# Altium project Kame_PDB.PrjPCB
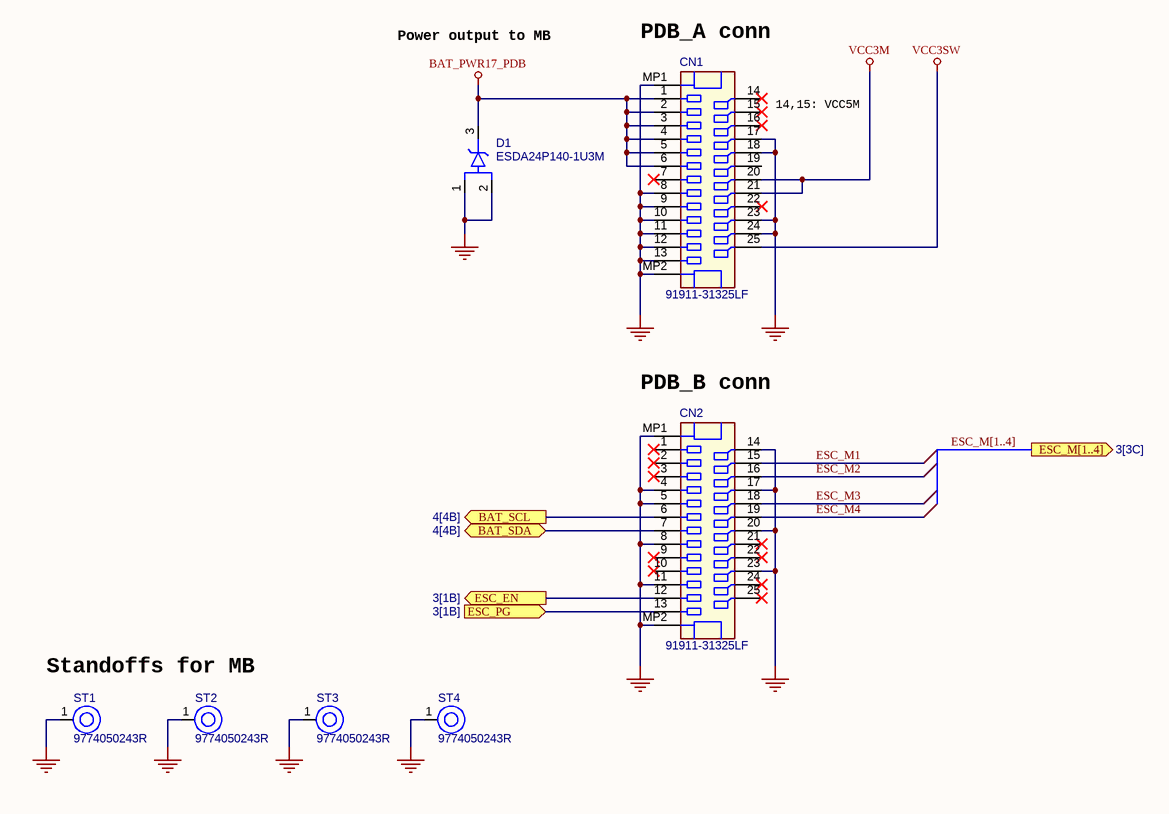
[diagram p0: 2_mb_conn.SchDoc]
Project: KAME_PDB; ProjectRev: 2
3 sheets, 50 parts. Net scope: flat (ports and power ports of the same name join across sheets).
Board file: Kame_PDB.PcbDoc
Sheets:
  2_mb_conn.SchDoc
  3_esc_power_sw.SchDoc
  4_bat_input&power_monitor.SchDoc

## Sheet 2_mb_conn.SchDoc: MB connectors
size A4; Revision: 2; SheetNumber: 2; SheetTotal: 4

### Parts
CN1  91911-31325LF  [AMPH-91911-31325_V]
CN2  91911-31325LF  [AMPH-91911-31325_V]
D1  ESDA24P140-1U3M  [STM-QFN3]
ST1  9774050243R  [WE-9774050243R_V]
ST2  9774050243R  [WE-9774050243R_V]
ST3  9774050243R  [WE-9774050243R_V]
ST4  9774050243R  [WE-9774050243R_V]

### Ports
BAT_SCL (out, see 4[4B]), BAT_SDA (bidir, see 4[4B]), ESC_EN (out, see 3[1B]), ESC_M[1..4] (out, see 3[3C]), ESC_PG (in, see 3[1B])

### Nets
BAT_PWR17_PDB: CN1.1 CN1.2 CN1.3 CN1.4 CN1.5 CN1.6 D1.3(K)
GND: CN1.8 CN1.9 CN1.10 CN1.11 CN1.12 CN1.13 CN1.17 CN1.18 CN1.23 CN1.24 CN1.MP1 CN1.MP2 CN2.4 CN2.5 CN2.8 CN2.11 CN2.14 CN2.17 CN2.20 CN2.23 CN2.MP1 CN2.MP2 D1.1(A) D1.2(A) ST1.1(H1) ST2.1(H1) ST3.1(H1) ST4.1(H1)
VCC3M: CN1.20 CN1.21
VCC3SW: CN1.25
BAT_SCL: CN2.6 ; port BAT_SCL
BAT_SDA: CN2.7 ; port BAT_SDA
ESC_EN: CN2.12 ; port ESC_EN
ESC_M1: CN2.15
ESC_M2: CN2.16
ESC_M3: CN2.18
ESC_M4: CN2.19
ESC_PG: CN2.13 ; port ESC_PG

Not connected (* = marked no-connect by the designer): CN1 7* 14* 15* 16* 19 22*; CN2 1* 2* 3* 9* 10* 21* 22* 24* 25*

### Buses and harness runs
bus ESC_M[1..4] = port ESC_M[1..4]

### Notes on the sheet
- Power output to MB
- (near CN1) PDB_A conn
- (near CN1) 14,15: VCC5M
- (near CN2) PDB_B conn
- Standoffs for MB
- Title
- Size:
- Date:
- A4
- Number:
- Time:
- Revision:
- Sheet
- of
- File:

### Library data of the parts
CN1 CN2 = CMP-002-00064-3: Header, Pitch 1 mm, 25 Position, Height 5 mm, -55 to 130 degC; Pins: 27
D1 = CMP-004-00029-3: TVS diode, 4500W, 22V standoff, 29.5V clamp; Peak Inverse Voltage: 22.7V; Forward Voltage: 700mV; Max Surge Current: 140A; Case/Package: 3-QFN; Mounting Technology: SMT; RoHS Compliant: Yes; Pins: 3
ST1-ST4 = CMP-00028-00006-2: WA-SMSI SMT Steel Spacer, M2 Thread Internal, Tin, RoHS, Tape and Reel; Pins: 1

## Sheet 3_esc_power_sw.SchDoc: ESC power switch
size A3; Revision: 2; SheetNumber: 3; SheetTotal: 4
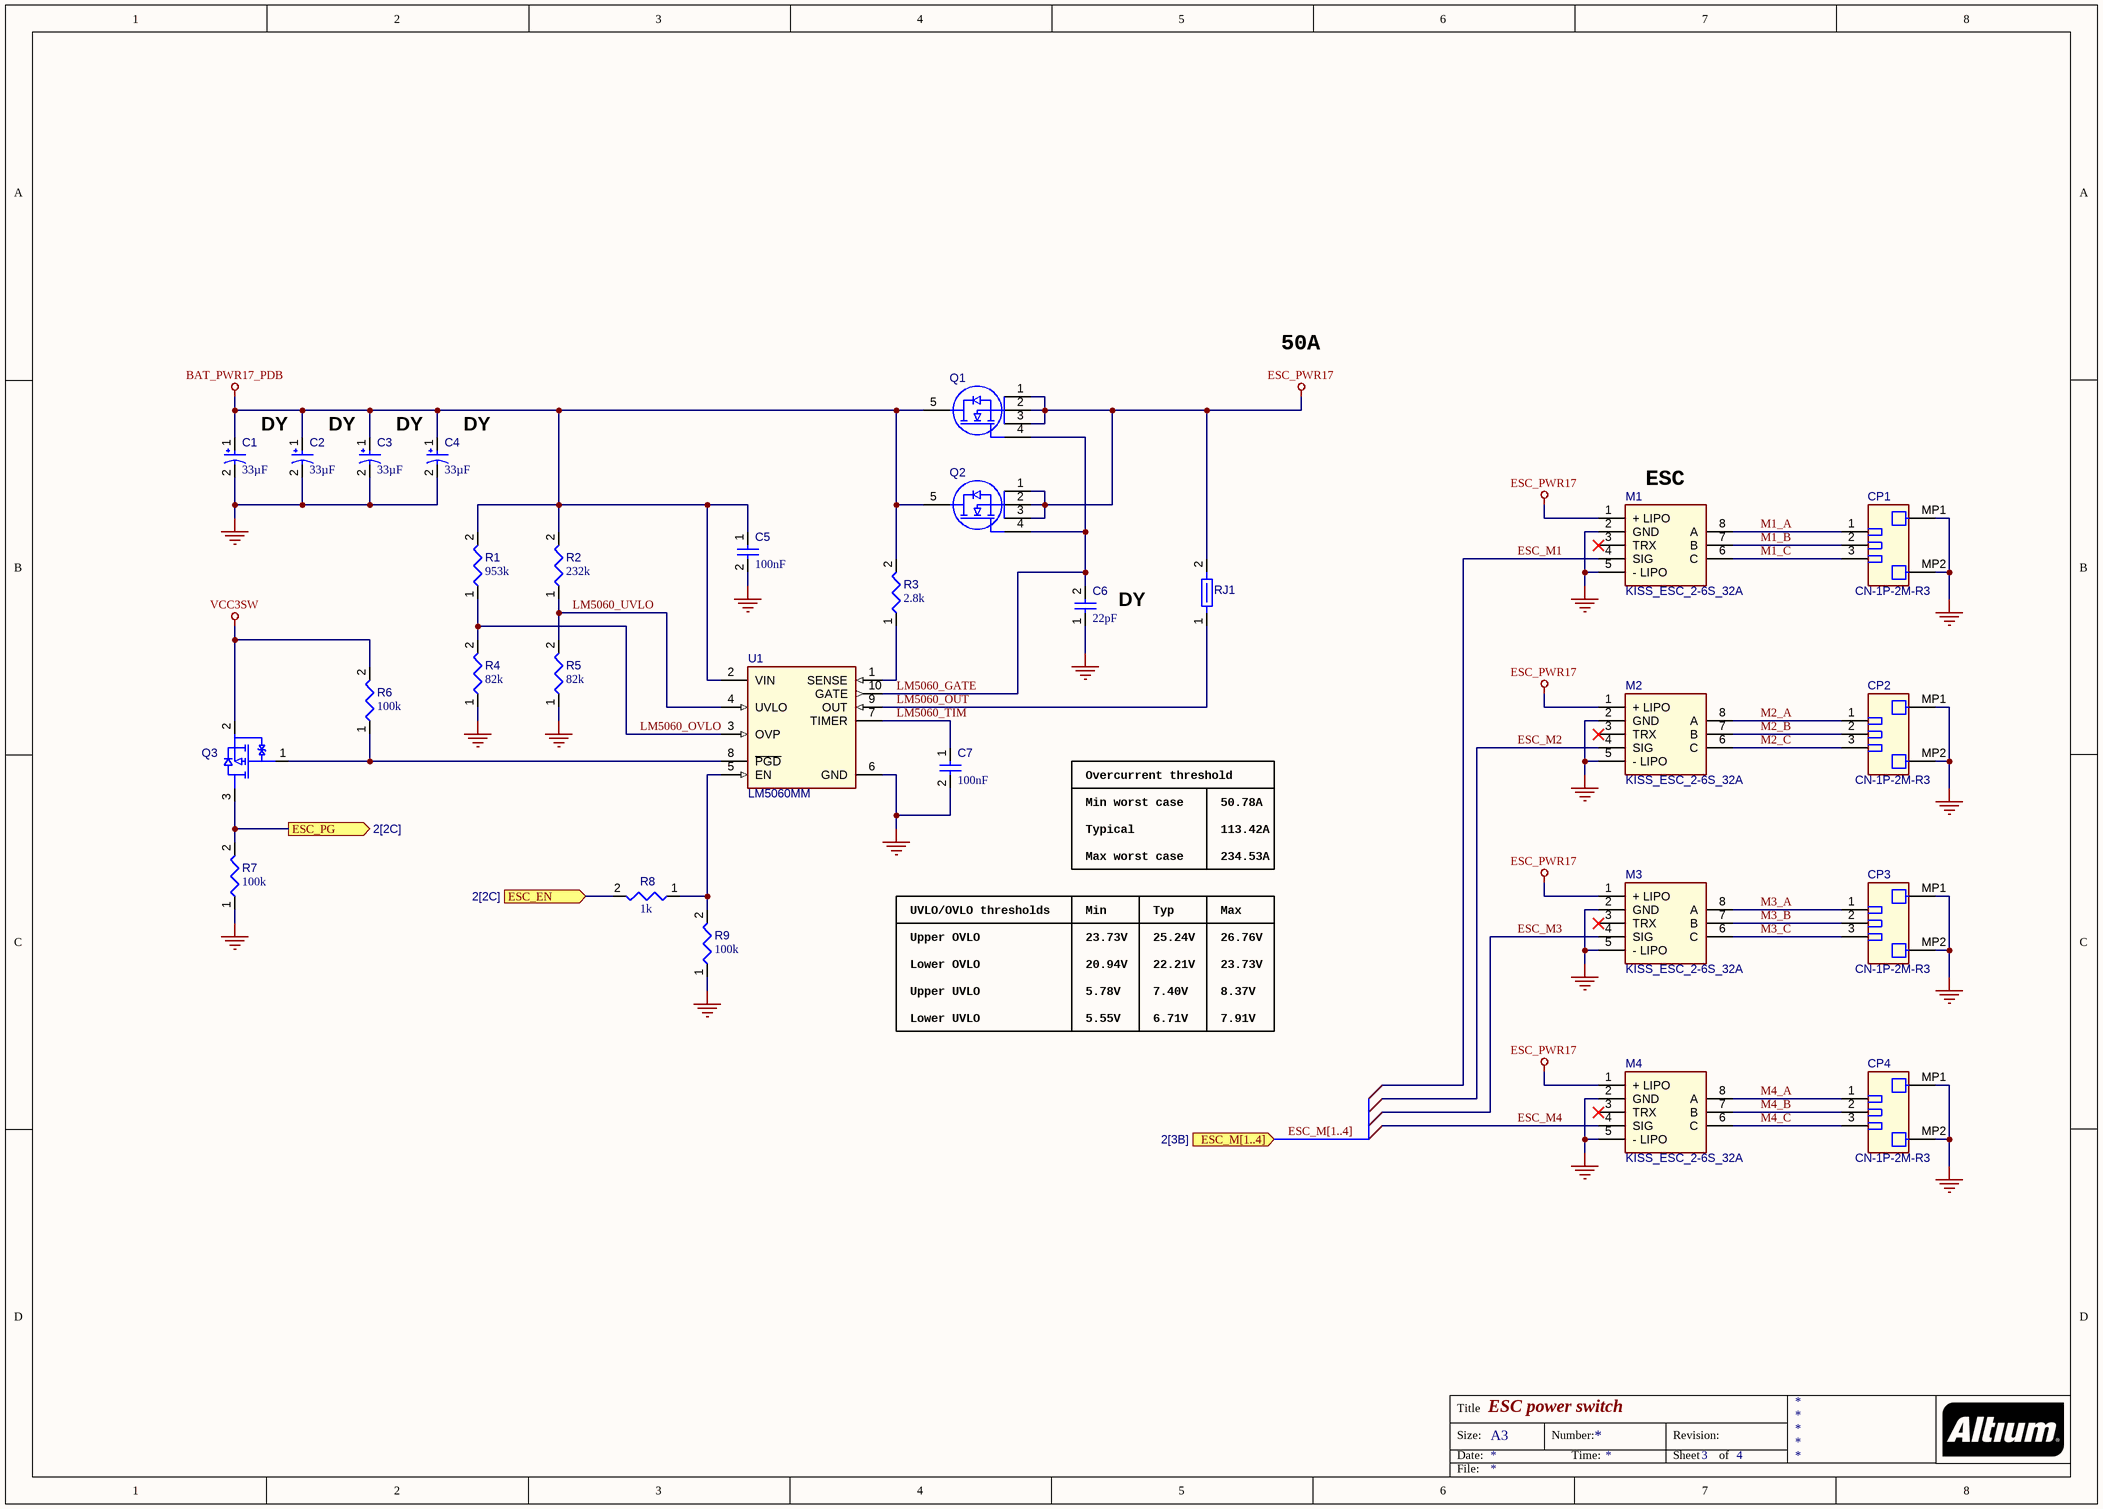
[diagram p1: 3_esc_power_sw.SchDoc]

### Parts
C1  value 33µF  [EEF-CX1E330R-Footprint-1]  (hidden comment: Capacitor 33µF +/-20% 25V 2917)
C2  value 33µF  [EEF-CX1E330R-Footprint-1]  (hidden comment: Capacitor 33µF +/-20% 25V 2917)
C3  value 33µF  [EEF-CX1E330R-Footprint-1]  (hidden comment: Capacitor 33µF +/-20% 25V 2917)
C4  value 33µF  [EEF-CX1E330R-Footprint-1]  (hidden comment: Capacitor 33µF +/-20% 25V 2917)
C5  value 100nF  [CAPC0402(1005)60_L]  (hidden comment: Capacitor 100nF +/-20% 50V 0402)
C6  value 22pF  [CAPC0402(1005)60_L]  (hidden comment: Capacitor 22pF +/-10% 50V 0402)
C7  value 100nF  [CAPC0402(1005)60_L]  (hidden comment: Capacitor 100nF +/-20% 50V 0402)
CP1  CN-1P-2M-R3  [MR30PW-FB-Footprint-1]
CP2  CN-1P-2M-R3  [MR30PW-FB-Footprint-1]
CP3  CN-1P-2M-R3  [MR30PW-FB-Footprint-1]
CP4  CN-1P-2M-R3  [MR30PW-FB-Footprint-1]
M1  KISS_ESC_2-6S_32A  [ESC 2-6S 32A-Footprint-1]
M2  KISS_ESC_2-6S_32A  [ESC 2-6S 32A-Footprint-1]
M3  KISS_ESC_2-6S_32A  [ESC 2-6S 32A-Footprint-1]
M4  KISS_ESC_2-6S_32A  [ESC 2-6S 32A-Footprint-1]
Q1  PSMN1R0-30YLDX  [NXP-SOT669_L]  (value not drawn)
Q2  PSMN1R0-30YLDX  [NXP-SOT669_L]  (value not drawn)
Q3  RZM002P02T2L  [ROHM-SOT723-3_V]  (value not drawn)
R1  value 953k  [RESC0402(1005)_L]  (hidden comment: Resistor 953K +/-1 % 0402 63 mW)
R2  value 232k  [RESC0402(1005)_L]  (hidden comment: Resistor 232K +/-1 % 0402 63 mW)
R3  value 2.8k  [RESC0402(1005)_L]  (hidden comment: Resistor 2K8  +/-1 % 0402 63 mW)
R4  value 82k  [RESC0402(1005)_L]  (hidden comment: Resistor 82K  +/-1 % 0402 63 mW)
R5  value 82k  [RESC0402(1005)_L]  (hidden comment: Resistor 82K  +/-1 % 0402 63 mW)
R6  value 100k  [RESC0402(1005)_L]  (hidden comment: Resistor 100K +/-1 % 0402 63 mW)
R7  value 100k  [RESC0402(1005)_L]  (hidden comment: Resistor 100K +/-1 % 0402 63 mW)
R8  value 1k  [RESC0402(1005)_L]  (hidden comment: Resistor 1K +/-5 % 0402 63 mW)
R9  value 100k  [RESC0402(1005)_L]  (hidden comment: Resistor 100K +/-1 % 0402 63 mW)
RJ1  Net Tie 10x8mil  [New footprint 1]  (value not drawn)  (net tie, no BOM)
U1  LM5060MM  [DGS0010A_N]

### Ports
ESC_EN (in, see 2[2C]), ESC_M[1..4] (in, see 2[3B]), ESC_PG (out, see 2[2C])

### Nets
BAT_PWR17_PDB: C1.1 C2.1 C3.1 C4.1 C5.1 Q1.5(D) Q2.5(D) R1.2 R2.2 R3.2 U1.2(VIN)
ESC_PWR17: M1.1(+_LIPO) M2.1(+_LIPO) M3.1(+_LIPO) M4.1(+_LIPO) Q1.1(S) Q1.2(S) Q1.3(S) Q2.1(S) Q2.2(S) Q2.3(S) RJ1.2
GND: C1.2 C2.2 C3.2 C4.2 C5.2 C6.1 C7.2 CP1.MP1 CP1.MP2 CP2.MP1 CP2.MP2 CP3.MP1 CP3.MP2 CP4.MP1 CP4.MP2 M1.2(GND) M1.5(-_LIPO) M2.2(GND) M2.5(-_LIPO) M3.2(GND) M3.5(-_LIPO) M4.2(GND) M4.5(-_LIPO) R4.1 R5.1 R7.1 R9.1 U1.6(GND)
VCC3SW: Q3.2(S) R6.2
ESC_EN: R8.2 ; port ESC_EN
ESC_M1: M1.4(SIG)
ESC_M2: M2.4(SIG)
ESC_M3: M3.4(SIG)
ESC_M4: M4.4(SIG)
ESC_PG: Q3.3(D) R7.2 ; port ESC_PG
LM5060_GATE: C6.2 Q1.4(G) Q2.4(G) U1.10(GATE)
LM5060_OUT: RJ1.1 U1.9(OUT)
LM5060_OVLO: R1.1 R4.2 U1.3(OVP)
LM5060_TIM: C7.1 U1.7(TIMER)
LM5060_UVLO: R2.1 R5.2 U1.4(UVLO)
M1_A: CP1.1 M1.8(A)
M1_B: CP1.2 M1.7(B)
M1_C: CP1.3 M1.6(C)
M2_A: CP2.1 M2.8(A)
M2_B: CP2.2 M2.7(B)
M2_C: CP2.3 M2.6(C)
M3_A: CP3.1 M3.8(A)
M3_B: CP3.2 M3.7(B)
M3_C: CP3.3 M3.6(C)
M4_A: CP4.1 M4.8(A)
M4_B: CP4.2 M4.7(B)
M4_C: CP4.3 M4.6(C)
NetQ3_1: Q3.1(G) R6.1 U1.8(~{PGD})
NetR3_1: R3.1 U1.1(SENSE)
NetR8_1: R8.1 R9.2 U1.5(EN)

Not connected (* = marked no-connect by the designer): M1 3(TRX)*; M2 3(TRX)*; M3 3(TRX)*; M4 3(TRX)*

### Buses and harness runs
bus ESC_M[1..4] = port ESC_M[1..4]

### Notes on the sheet
- 50A
- DY
- (near C4) DY
- (near M1) ESC
- (near C6) DY
- Overcurrent threshold
- Min worst case
- Typical
- Max worst case
- 50.78A
- 113.42A
- 234.53A
- UVLO/OVLO thresholds
- Min
- Typ
- Max
- Upper OVLO
- Lower OVLO
- Upper UVLO
- 23.73V
- 20.94V
- 5.78V
- 25.24V
- 22.21V
- 7.40V
- 26.76V
- 8.37V
- Lower UVLO
- 5.55V
- 6.71V
- 7.91V
- Title
- Size:
- Date:
- A3
- Number:
- Time:
- Revision:
- Sheet
- of
- File:

### Library data of the parts
C1-C4 = CMP-001-00064-3: Aluminum Organic Polymer Capacitors 33uF 25volt SP-Cap AEC-Q200; Tolerance: 20%; Case/Package: 2917; Voltage Rating: 25V; Mounting Technology: SMT; Min Operating Temperature: -40°C; Max Operating Temperature: 105°C; Pins: 2
C5 C7 = CMP-001-00067-3: Chip Capacitor, 100nF +/-20%, 50V, 0402, Thickness 0.6 mm; Tolerance: 10%; Mounting Technology: SMT; Voltage Rating: 50V; Pins: 2; Case/Package: 0402; Max Operating Temperature: 85°C; Min Operating Temperature: -55°C
C6 = CMP-001-00073-3: Chip Capacitor, 22pF +/-10%, 50V, 0402, Thickness 0.6 mm; Tolerance: 10%; Mounting Technology: SMT; Pins: 2; Voltage Rating: 50V; Case/Package: 0402; Max Operating Temperature: 85°C; Min Operating Temperature: -55°C
CP1-CP4 = CMP-002-00056-3: AMASS 500V 15A   0.8 mOhm; Pins: 5
M1-M4 = CMP-00030-00000-2: KISS ESC 2-6S 32A (45A limit) - 32bit brushless Motor Ctrl; Pins: 8
Q1 Q2 = CMP-013-00029-2: N-channel Logic Level MOSFET, 30 V, 300 A, -55 to 175 degC, 5-Pin SOT669, RoHS, Tape and Reel; Transistor Type: 1N-Channel; Vgs (Max): 20V; Pins: 5; RoHS Compliant: True
Q3 = CMP-013-00027-2: Pch Small Signal MOSFET, 20 V, 200 mA, 3-Pin SOT723, RoHS, Tape and Reel; Vgs(th) (Max) @ Id: 1V@100µA; Pins: 3
R1 = CMP-009-00125-3: Chip Resistor, 953 kOhms, +/-1 %, 63 mW, -55 to 155 degC, 0402; Power: 63mW; Tolerance: 1%; Case/Package: 0402; Max Operating Temperature: 155°C; Min Operating Temperature: -55°C; Pins: 2
R2 = CMP-009-00127-3: Chip Resistor, 232 kOhms, +/-1 %, 63 mW, -55 to 155 degC, 0402; Tolerance: 1%; Power: 63mW; Case/Package: 0402; Pins: 2
R3 = CMP-009-00156-3: Chip Resistor, 2,8 kOhms, +/-1 %, 63 mW, -55 to 155 degC, 0402; Power: 63mW; Tolerance: 1%; Case/Package: 0402; Pins: 2
R4 R5 = CMP-009-00140-3: Chip Resistor, 82 kOhms, +/-1 %, 63 mW, -55 to 155 degC, 0402; Tolerance: 1%; Power: 63mW; Case/Package: 0402; Pins: 2
R6 R7 R9 = CMP-009-00168-3: Chip Resistor, 100 kOhms, +/-1 %, 63 mW, -55 to 155 degC, 0402; Tolerance: 1%; Power: 63mW; Case/Package: 0402; Max Operating Temperature: 155°C; Min Operating Temperature: -55°C; Pins: 2
R8 = CMP-009-00157-3: Chip Resistor, 1 kOhms, +/-5 %, 63 mW, -55 to 155 degC, 0402; Tolerance: 5%; Power: 63mW; Case/Package: 0402; Max Operating Temperature: 155°C; Min Operating Temperature: -55°C; Pins: 2
RJ1 = CMP-009-00116-2: Pins: 2; Max Operating Temperature: 155°C; Min Operating Temperature: -55°C
U1 = CMP-019-00039-3: High-Side Protection Controller with Low Quiescent Current, 5.5 to 65 V, -40 to 125 degC, 10-Pin VSSOP, RoHS, Tape and Reel; Max Supply Voltage: 65V; Min Supply Voltage: 5.5V; Min Operating Temperature: -40°C; Max Operating Temperature: 125°C; Pins: 10

## Sheet 4_bat_input&power_monitor.SchDoc: Battery input & Power monitor
size A4; Revision: 2; SheetNumber: 4; SheetTotal: 4
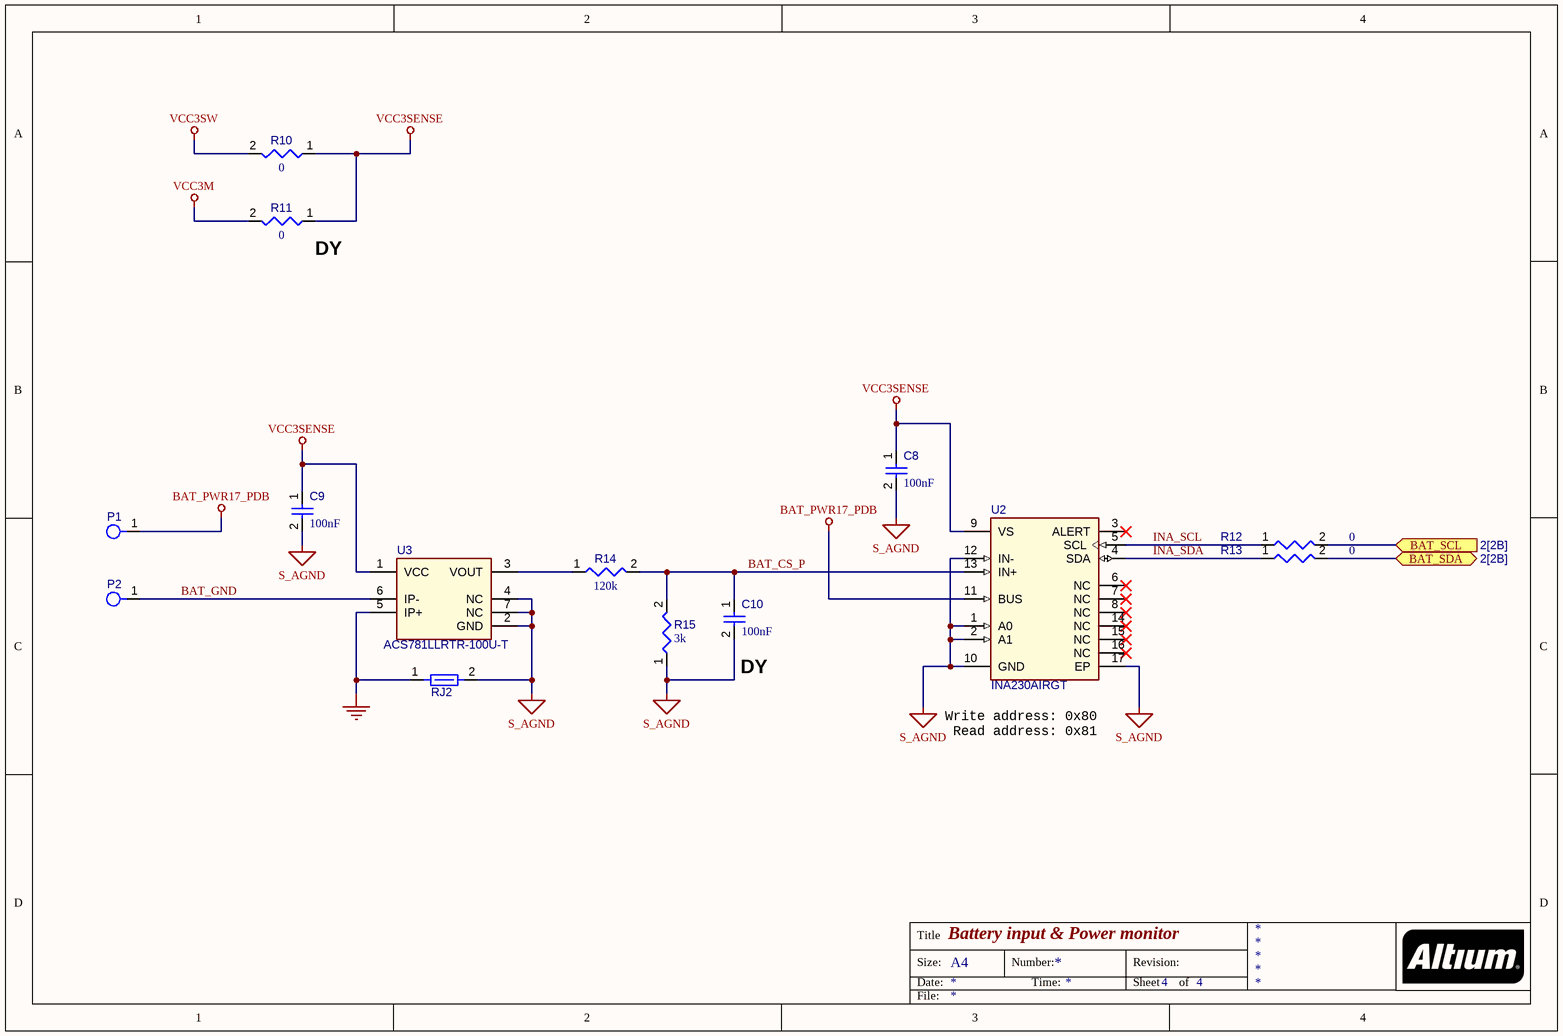
[diagram p2: 4_bat_input&power_monitor.SchDoc]

### Parts
C8  value 100nF  [CAPC0402(1005)60_L]  (hidden comment: Capacitor 100nF +/-20% 50V 0402)
C9  value 100nF  [CAPC0402(1005)60_L]  (hidden comment: Capacitor 100nF +/-20% 50V 0402)
C10  value 100nF  [CAPC0402(1005)60_L]  (hidden comment: Capacitor 100nF +/-20% 50V 0402)
P1  WIRE_PAD_7x4  [WIRE_PAD_7x4-Footprint-1]  (value not drawn)  (no BOM)
P2  WIRE_PAD_7x4  [WIRE_PAD_7x4-Footprint-1]  (value not drawn)  (no BOM)
R10  value 0  [RESC0402(1005)_L]  (hidden comment: Jumper 0402)
R11  value 0  [RESC0402(1005)_L]  (hidden comment: Jumper 0402)
R12  value 0  [RESC0402(1005)_L]  (hidden comment: Jumper 0402)
R13  value 0  [RESC0402(1005)_L]  (hidden comment: Jumper 0402)
R14  value 120k  [RESC0402(1005)_L]  (hidden comment: Resistor 120K +/-1 % 0402 63 mW)
R15  value 3k  [RESC0402(1005)_L]  (hidden comment: Resistor 3K +/-1 % 0402 63 mW)
RJ2  Net Tie 10x8mil  [New footprint 1]  (value not drawn)  (net tie, no BOM)
U2  INA230AIRGT  [RGT0016C_V]
U3  ACS781LLRTR-100U-T  [ALEG-PSOF-7_V]

### Ports
BAT_SCL (in, see 2[2B]), BAT_SDA (bidir, see 2[2B])

### Nets
BAT_PWR17_PDB: P1.1(H1) U2.11(BUS)
GND: RJ2.1 U3.5(IP+)
S_AGND: C8.2 C9.2 C10.2 R15.1 RJ2.2 U2.1(A0) U2.2(A1) U2.10(GND) U2.12(IN-) U2.17(EP) U3.2(GND) U3.4(NC) U3.7(NC)
VCC3M: R11.2
VCC3SENSE: C8.1 C9.1 R10.1 R11.1 U2.9(VS) U3.1(VCC)
VCC3SW: R10.2
BAT_CS_P: C10.1 R14.2 R15.2 U2.13(IN+)
BAT_GND: P2.1(H1) U3.6(IP-)
BAT_SCL: R12.2 ; port BAT_SCL
BAT_SDA: R13.2 ; port BAT_SDA
INA_SCL: R12.1 U2.5(SCL)
INA_SDA: R13.1 U2.4(SDA)
NetR14_1: R14.1 U3.3(VOUT)

Not connected (* = marked no-connect by the designer): U2 3(ALERT)* 6(NC)* 7(NC)* 8(NC)* 14(NC)* 15(NC)* 16(NC)*

### Notes on the sheet
- (near R11) DY
- (near C10) DY
- (near U2) Write address: 0x80
  Read address: 0x81
- Title
- Size:
- Date:
- A4
- Number:
- Time:
- Revision:
- Sheet
- of
- File:

### Library data of the parts
C8-C10 = CMP-001-00067-3: as C5 on sheet 3_esc_power_sw; Mounting Technology: SMT; Voltage Rating: 50V; Pins: 2; Case/Package: 0402; Max Operating Temperature: 85°C; Min Operating Temperature: -55°C
P1 P2 = CMP-019-00043-3: SMD WIRE PAD 7 x 4 mm; Pins: 1
R10-R13 = CMP-009-00148-3: Case/Package: 0402; Max Operating Temperature: 155°C; Min Operating Temperature: -55°C; Pins: 2
R14 = CMP-009-00146-3: Chip Resistor, 120 kOhms, +/-1 %, 63 mW, -55 to 155 degC, 0402; Tolerance: 1%; Power: 63mW; Case/Package: 0402; Max Operating Temperature: 155°C; Min Operating Temperature: -55°C; Pins: 2
R15 = CMP-009-00145-3: Chip Resistor, 3 kOhms, +/-1 %, 63 mW, -55 to 155 degC, 0402; Power: 63mW; Tolerance: 1%; Case/Package: 0402; Max Operating Temperature: 155°C; Min Operating Temperature: -55°C; Pins: 2
RJ2 = CMP-009-00116-2: Pins: 2; Max Operating Temperature: 155°C; Min Operating Temperature: -55°C
U2 = CMP-014-00001-3: High or Low Side Measurement, 2.7 to 5.5 V, -40 to 125 degC, 16-Pin QFN, RoHS, Tape and Reel; Mounting Technology: SurfaceMount; Pins: 17
U3 = CMP-031-00005-2: High-Precision Linear Hall-Effect-Based Current Sensor IC with 200 u? Current Conductor, 3 to 3.6 V, -40 to 150 degC, 7-Pin PSOF, RoHS, Tape and Reel; Pins: 7

## Nets that join several sheets
BAT_PWR17_PDB: 2_mb_conn (7 pins), 3_esc_power_sw (11 pins), 4_bat_input&power_monitor (P1.1 U2.11)
GND: 2_mb_conn (28 pins), 3_esc_power_sw (28 pins), 4_bat_input&power_monitor (RJ2.1 U3.5)
VCC3M: 2_mb_conn (CN1.20 CN1.21), 4_bat_input&power_monitor (R11.2)
VCC3SW: 2_mb_conn (CN1.25), 3_esc_power_sw (Q3.2 R6.2), 4_bat_input&power_monitor (R10.2)
BAT_SCL: 2_mb_conn (CN2.6), 4_bat_input&power_monitor (R12.2)
BAT_SDA: 2_mb_conn (CN2.7), 4_bat_input&power_monitor (R13.2)
ESC_EN: 2_mb_conn (CN2.12), 3_esc_power_sw (R8.2)
ESC_M1: 2_mb_conn (CN2.15), 3_esc_power_sw (M1.4)
ESC_M2: 2_mb_conn (CN2.16), 3_esc_power_sw (M2.4)
ESC_M3: 2_mb_conn (CN2.18), 3_esc_power_sw (M3.4)
ESC_M4: 2_mb_conn (CN2.19), 3_esc_power_sw (M4.4)
ESC_PG: 2_mb_conn (CN2.13), 3_esc_power_sw (Q3.3 R7.2)

## Assembly variants
Default: not fitted C1 C2 C3 C4 C7 C9 R11